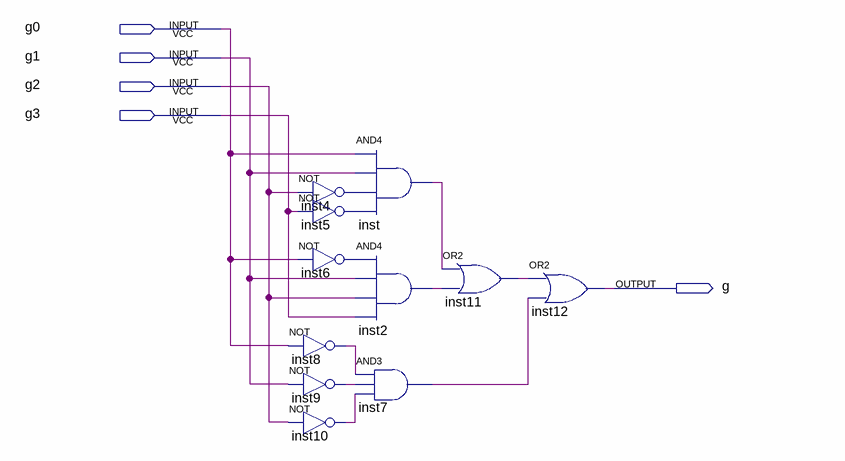
[diagram p0: schematic sheet]
// Quartus schematic g_segment.bdf as structural Verilog: 11 symbols, 5 pins
module g_segment (
  input  g0,
  input  g1,
  input  g2,
  input  g3,
  output g
);

  wire inst2_out, inst4_out, inst5_out, inst6_out, inst7_out, inst8_out, inst9_out, inst10_out, inst11_out,
       inst_out;

  and inst (inst_out, g0, g1, inst4_out, inst5_out);
  not inst4 (inst4_out, g2);
  not inst5 (inst5_out, g3);
  and inst2 (inst2_out, inst6_out, g1, g2, g3);
  not inst6 (inst6_out, g0);
  not inst8 (inst8_out, g0);
  and inst7 (inst7_out, inst8_out, inst9_out, inst10_out);
  not inst9 (inst9_out, g1);
  not inst10 (inst10_out, g2);
  or inst11 (inst11_out, inst_out, inst2_out);
  or inst12 (g, inst11_out, inst7_out);
endmodule
